# Altium schematic sheet toplevel.SchDoc: Toplevel Schematic for Motherboard
size B
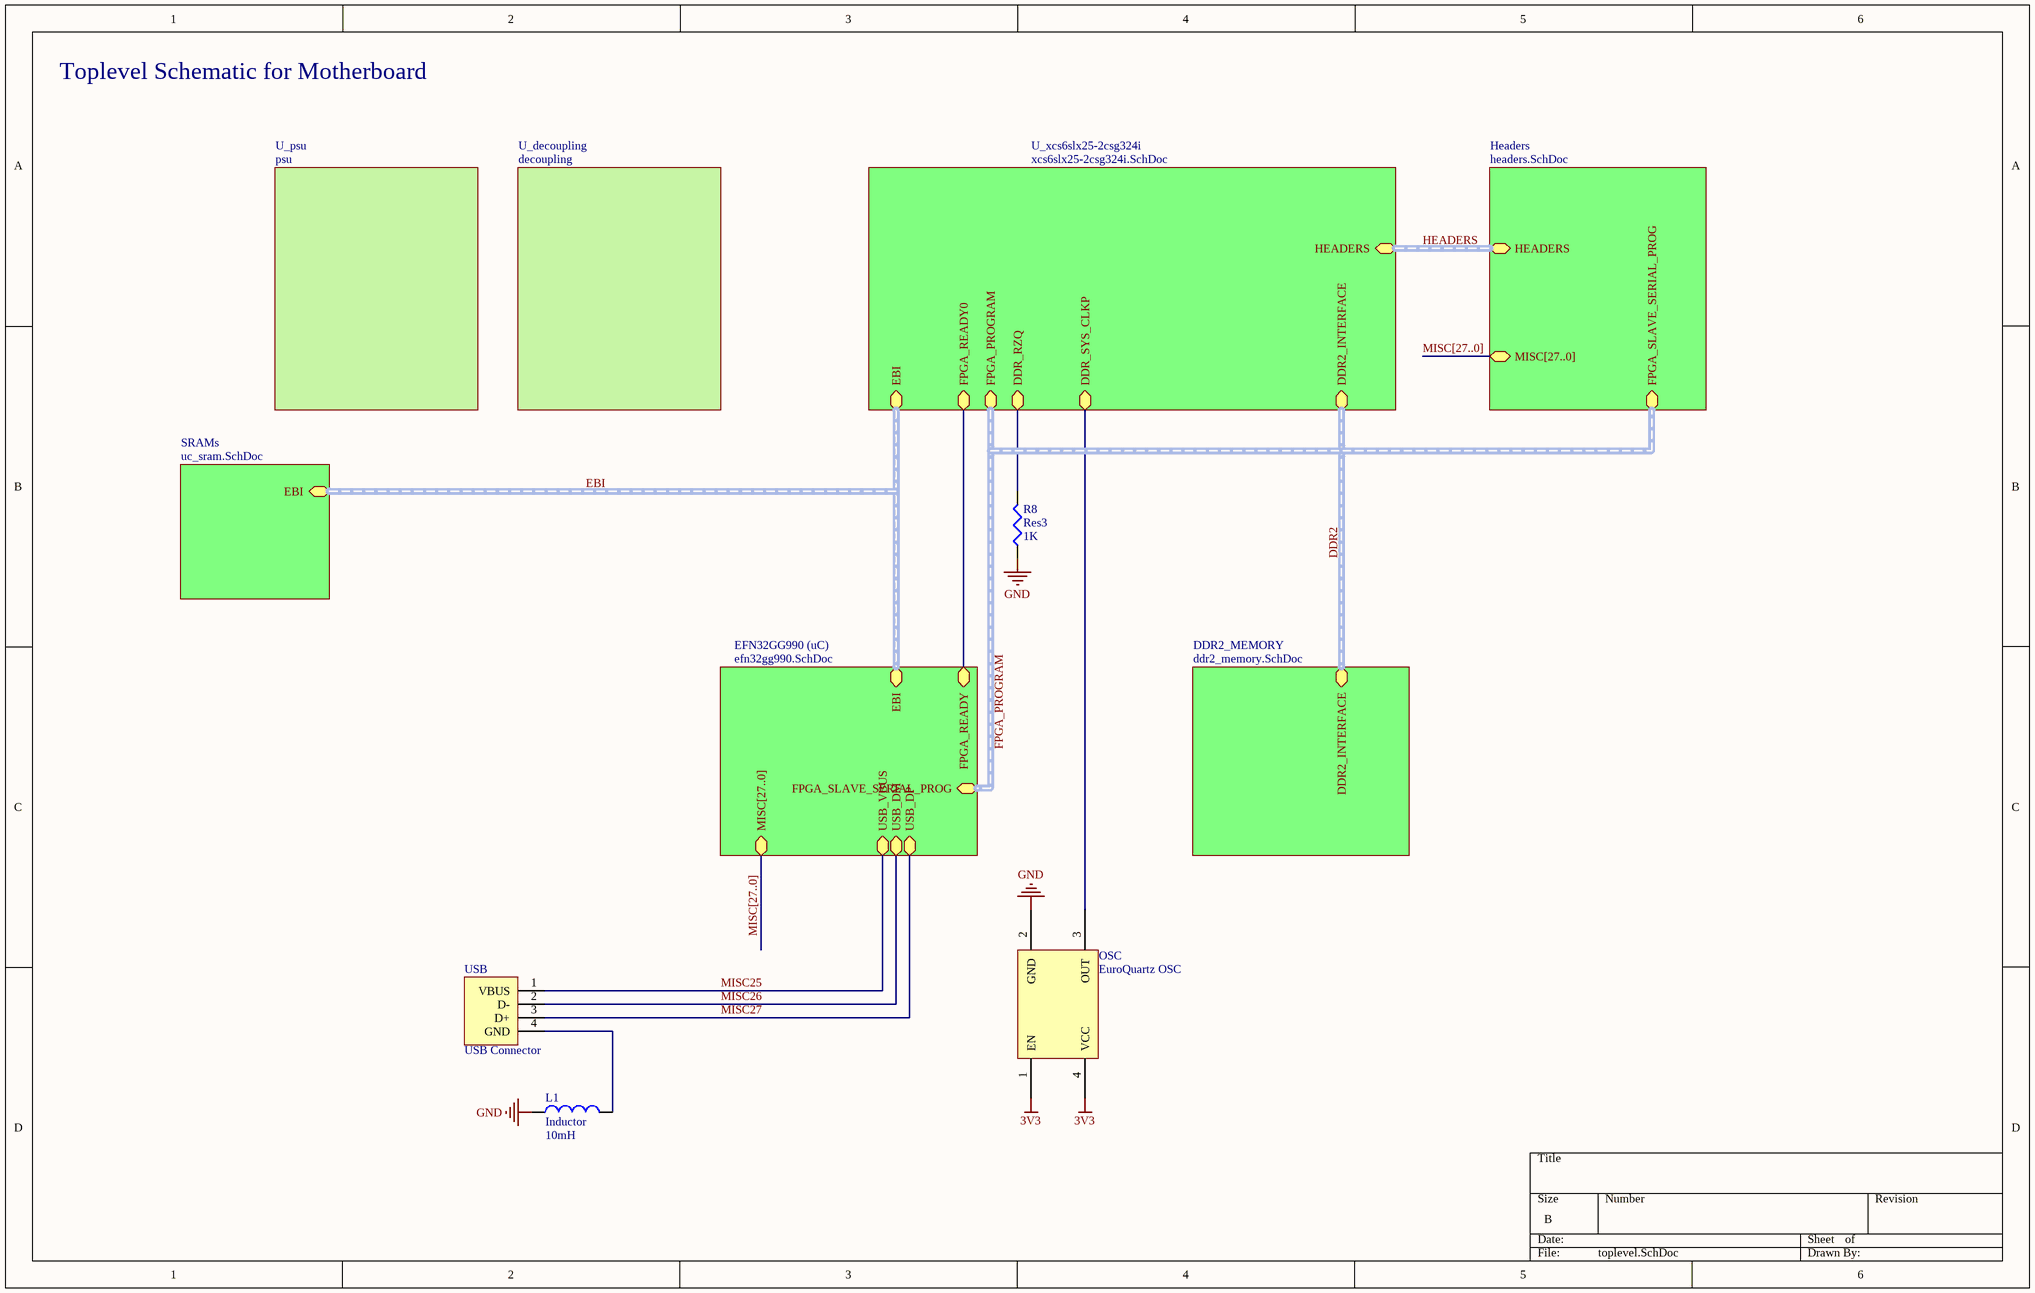
[diagram p0: toplevel.SchDoc]

## Parts
L1  Inductor  value 10mH  [C1210]
OSC  EuroQuartz OSC  [SOP4]
R8  Res3  value 1K  [14-1210]
USB  USB Connector  [USB2.5-2H4D]

## Sub-sheets
DDR2_MEMORY = ddr2_memory.SchDoc: DDR2_INTERFACE (harness DDR2_INTERFACE)
EFN32GG990 (uC) = efn32gg990.SchDoc: USB_VBUS, USB_DP, USB_DM, FPGA_READY, FPGA_SLAVE_SERIAL_PROG (harness FPGA_SLAVE_SERIAL_PROG), EBI (harness EBI), MISC[27..0]
Headers = headers.SchDoc: HEADERS (harness HEADERS), MISC[27..0], FPGA_SLAVE_SERIAL_PROG (harness FPGA_SLAVE_SERIAL_PROG)
SRAMs = uc_sram.SchDoc: EBI (harness EBI)
U_decoupling = decoupling: no entries
U_psu = psu: no entries
U_xcs6slx25-2csg324i = xcs6slx25-2csg324i.SchDoc: FPGA_READY0, DDR_RZQ, DDR_SYS_CLKP, DDR2_INTERFACE (harness DDR2_INTERFACE), FPGA_PROGRAM (harness FPGA_SLAVE_SERIAL_PROG), EBI (harness EBI), HEADERS (harness HEADERS)

## Nets
3V3: OSC.1(EN) OSC.4(VCC)
GND: L1.1 OSC.2(GND) R8.1
MISC25: USB.1(VBUS) ; sheet EFN32GG990 (uC)/USB_VBUS
MISC26: USB.2(D-) ; sheet EFN32GG990 (uC)/USB_DM
MISC27: USB.3(D+) ; sheet EFN32GG990 (uC)/USB_DP
NetL1_2: L1.2 USB.4(GND)
NetOSC_3: OSC.3(OUT) ; sheet U_xcs6slx25-2csg324i/DDR_SYS_CLKP
NetR8_2: R8.2 ; sheet U_xcs6slx25-2csg324i/DDR_RZQ
(unnamed): sheet EFN32GG990 (uC)/FPGA_READY, sheet U_xcs6slx25-2csg324i/FPGA_READY0

## Buses and harness runs
bus MISC[27..0] = sheet EFN32GG990 (uC)/MISC[27..0]
bus MISC[27..0] = sheet Headers/MISC[27..0]
harness DDR2 = sheet DDR2_MEMORY/DDR2_INTERFACE = sheet U_xcs6slx25-2csg324i/DDR2_INTERFACE
harness EBI = sheet EFN32GG990 (uC)/EBI = sheet SRAMs/EBI = sheet U_xcs6slx25-2csg324i/EBI
harness FPGA_PROGRAM = sheet EFN32GG990 (uC)/FPGA_SLAVE_SERIAL_PROG = sheet Headers/FPGA_SLAVE_SERIAL_PROG = sheet U_xcs6slx25-2csg324i/FPGA_PROGRAM
harness HEADERS = sheet Headers/HEADERS = sheet U_xcs6slx25-2csg324i/HEADERS

## Notes on the sheet
- Toplevel Schematic for Motherboard

## Library data of the parts
L1 = Inductor: Code_IEC: 1005; Published: 8-Jun-2000; LatestRevisionDate: 29-May-2009; LatestRevisionNote: IPC-7351 Footprint Added.; PackageReference: 0402-A; Publisher: Altium Limited; PackageDescription: Chip Inductor; Code_JEITA: 0402
OSC = EuroQuartz OSC: XO53050UITA
R8 = Res3: Resistor; Published: 8-Jun-2000; LatestRevisionDate: 29-May-2009; LatestRevisionNote: IPC-7351 Footprint Added.; PackageReference: J1-0603; Publisher: Altium Limited; PackageDescription: Chip Resistor